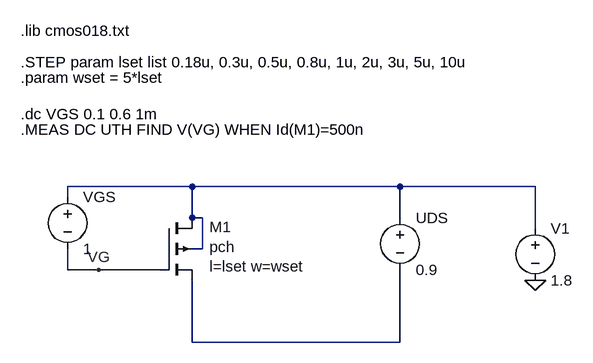
[diagram p0: schematic Draft1P.asc]
Draft1P.asc, the LTspice schematic file:
Version 4
SHEET 1 1356 680
WIRE 224 176 32 176
WIRE 544 176 224 176
WIRE 752 176 544 176
WIRE 32 192 32 176
WIRE 224 224 224 176
WIRE 240 224 224 224
WIRE 544 224 544 176
WIRE 752 240 752 176
WIRE 240 272 240 224
WIRE 240 272 224 272
WIRE 32 304 32 272
WIRE 80 304 32 304
WIRE 176 304 80 304
WIRE 224 416 224 320
WIRE 544 416 544 304
WIRE 544 416 224 416
FLAG 80 304 VG
FLAG 752 320 0
SYMBOL pmos4 176 224 R0
WINDOW 123 75 75 Left 2
WINDOW 0 75 14 Left 2
WINDOW 3 75 45 Left 2
SYMATTR Value2 l=lset w=wset
SYMATTR InstName M1
SYMATTR Value pch
SYMBOL voltage 32 176 R0
WINDOW 123 0 0 Left 0
WINDOW 39 0 0 Left 0
SYMATTR InstName VGS
SYMATTR Value 1
SYMBOL voltage 544 208 R0
WINDOW 123 0 0 Left 0
WINDOW 39 0 0 Left 0
SYMATTR InstName UDS
SYMATTR Value 0.9
SYMBOL voltage 752 224 R0
WINDOW 123 0 0 Left 0
WINDOW 39 0 0 Left 0
SYMATTR InstName V1
SYMATTR Value 1.8
TEXT -40 -64 Left 2 !.lib cmos018.txt
TEXT -40 -16 Left 2 !.STEP param lset list 0.18u, 0.3u, 0.5u, 0.8u, 1u, 2u, 3u, 5u, 10u
TEXT -40 8 Left 2 !.param wset = 5*lset
TEXT -40 64 Left 2 !.dc VGS 0.1 0.6 1m
TEXT -40 88 Left 2 !.MEAS DC UTH FIND V(VG) WHEN Id(M1)=500n

The netlist it stands for:
* Draft1P.asc
M1 N001 VG N002 N001 pch l=lset w=wset
VGS N001 VG 1
V§UDS N001 N002 0.9
V1 N001 0 1.8
.model NMOS NMOS
.model PMOS PMOS
.lib standard.mos
.lib cmos018.txt
.STEP param lset list 0.18u, 0.3u, 0.5u, 0.8u, 1u, 2u, 3u, 5u, 10u
.param wset = 5*lset
.dc VGS 0.1 0.6 1m
.MEAS DC UTH FIND V(VG) WHEN Id(M1)=500n
.backanno
.end